# EAGLE design ERPIHAT01 (EAGLE 7.1.0)
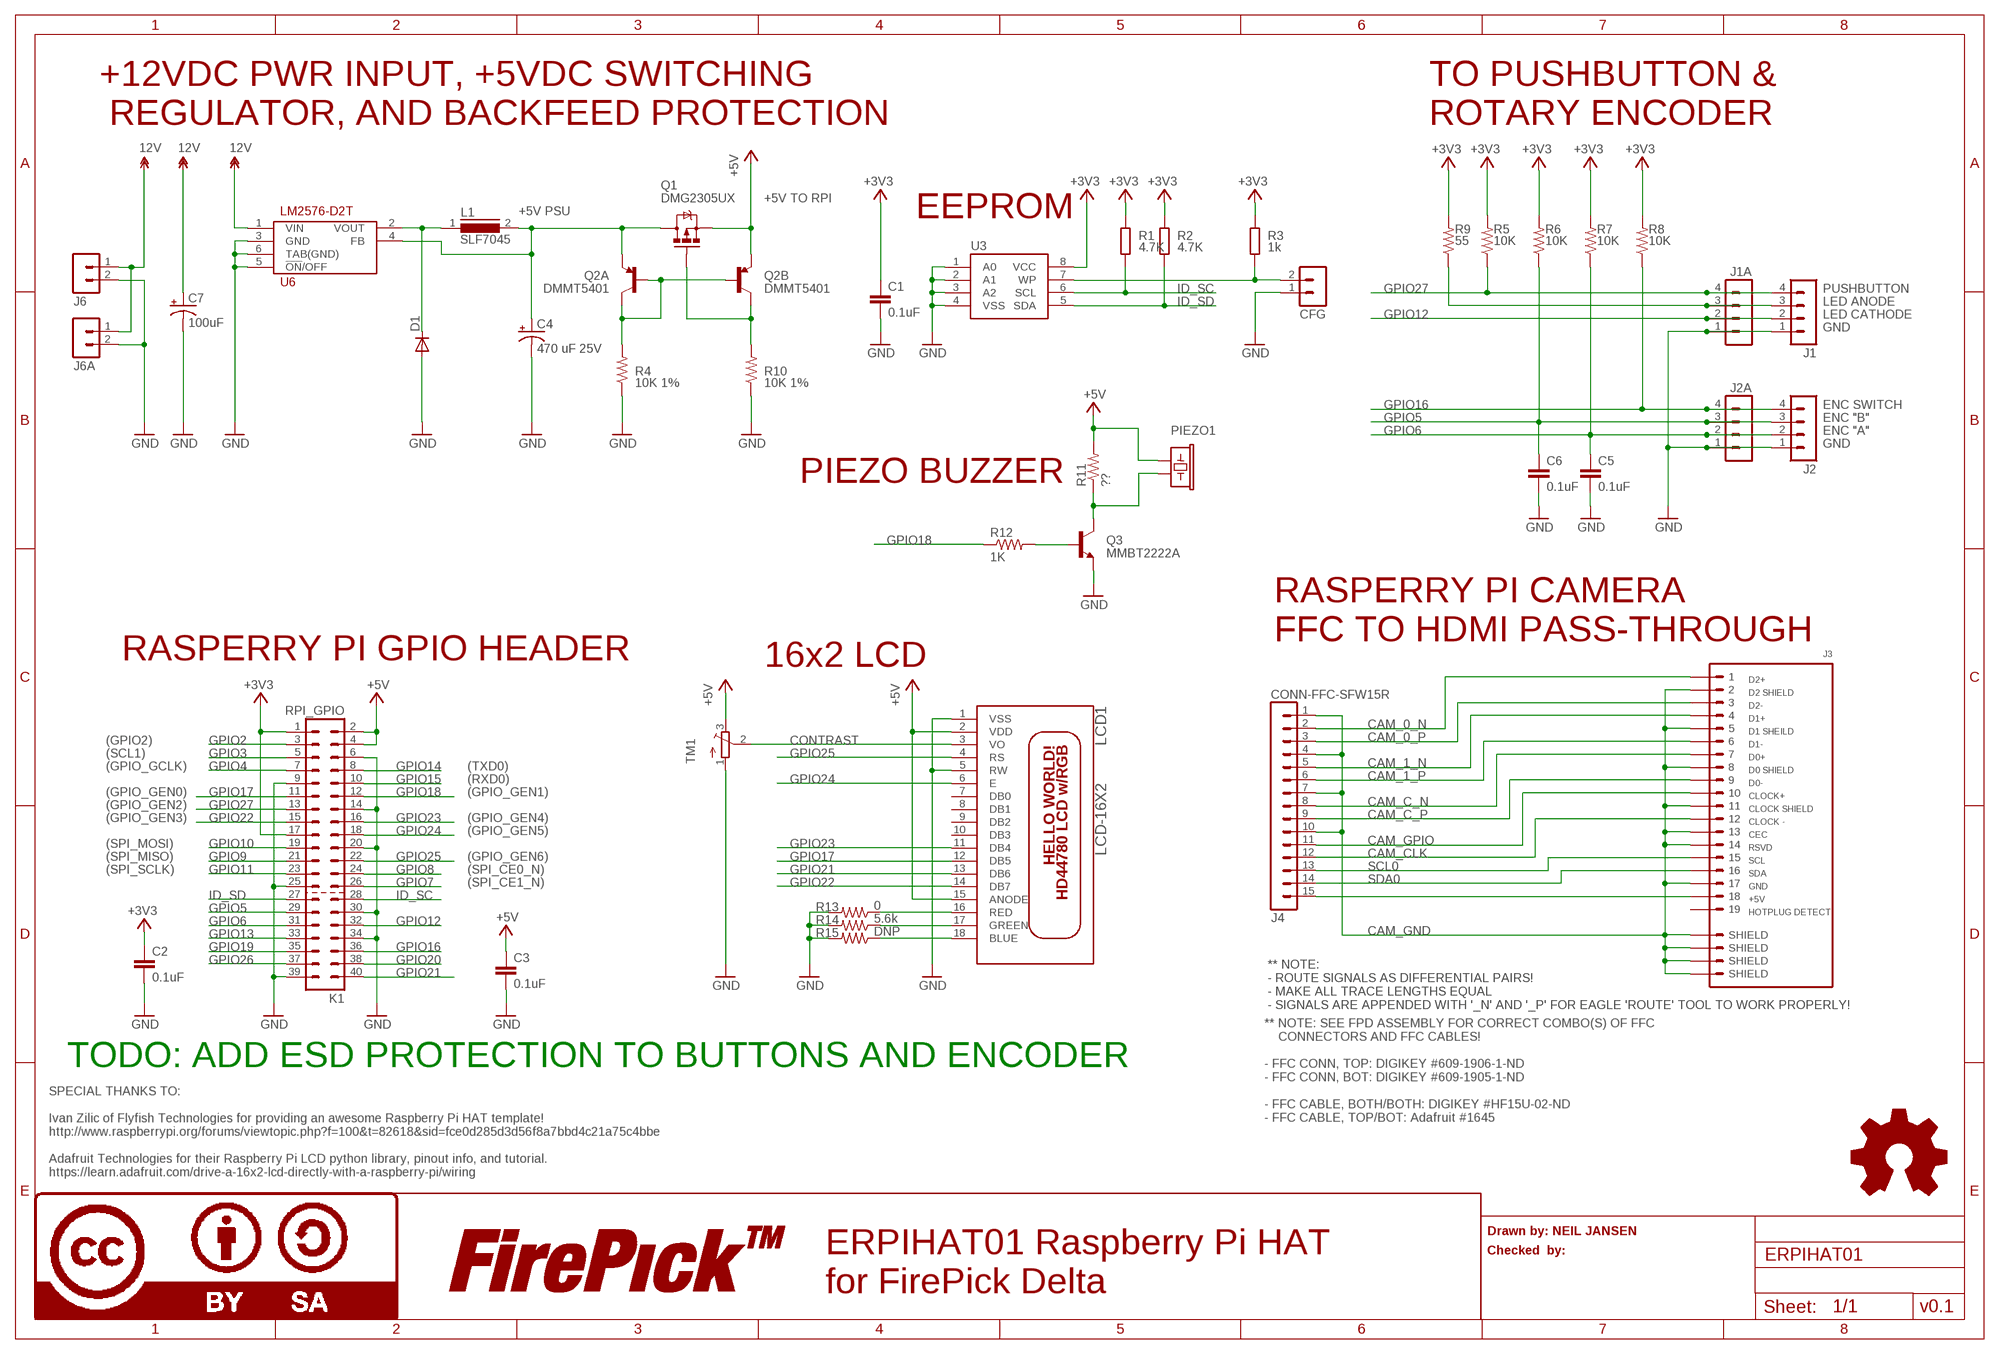
[diagram p0: schematic, sheet 1]

## Parts
C1  0.1uF  C-EUC0805K  [C0805K]
C2  0.1uF  C-EUC0805K  [C0805K]
C3  0.1uF  C-EUC0805K  [C0805K]
C4  470 uF 25V  CPOL-USD  [PANASONIC_D]
C5  0.1uF  CAP0805  [0805]
C6  0.1uF  CAP0805  [0805]
C7  100uF  CPOL-USD  [PANASONIC_D]
CFG  MA02-1  [MA02-1]
D1  DIODE-DO-214AC  [DO-214AC]
J1  CONN-RECT-4PINJST-PH-2MM  [CONN-JST-PH_2.0MM_4PIN-SMT-RA]
J1A  MA04-1  [MA04-1]
J2  CONN-RECT-4PINJST-PH-2MM  [CONN-JST-PH_2.0MM_4PIN-SMT-RA]
J2A  MA04-1  [MA04-1]
J3  CONN-HDMI  [CON-HDMI-FCI-10029449-001RLF]
J4  CONN-FFC-SFW15R  [CON-FFC-SFW15R]
J6  CONN-RECT-2PIN  [CONN-JST_PH-2.0MM-2PIN-SMT-RA]
J6A  MA02-1  [MA02-1]
K1  RPI_GPIO  PIN20X2  [PIN_20X2]
L1  SLF7045  [SLF7045]
LCD1  LCD-16X2  [LCD-16X2]
LOGO1  LOGO-FIREPICK  [LOGO-FIREPICK]
LOGO2  LOGO-OSHWMEDIUM  [LOGO-OSHW-MEDIUM]
LOGO3  LOGO-CC-BY-SA  [LOGO-CC-BY-SA]
PIEZO1  BUZZERPTH  [BUZZER-12MM]
Q1  DMG2305UX  MOSFET-PCHANNEL  [SOT23-3]
Q2  DMMT5401  [SOT23-6]
Q3  MMBT2222A  TRANSISTOR_NPNMMBT2222A  [SOT23-3]
R1  4.7K  R-EU_M0805  [M0805]
R2  4.7K  R-EU_M0805  [M0805]
R3  1k  R-EU_M0805  [M0805]
R4  10K 1%  RESISTOR0805-RES  [0805]
R5  10K  RESISTOR0805-RES  [0805]
R6  10K  RESISTOR0805-RES  [0805]
R7  10K  RESISTOR0805-RES  [0805]
R8  10K  RESISTOR0805-RES  [0805]
R9  55  RESISTOR0805-RES  [0805]
R10  10K 1%  RESISTOR0805-RES  [0805]
R11  ??  RESISTOR0805-RES  [0805]
R12  1K  RESISTOR0805-RES  [0805]
R13  0  RESISTOR0805-RES  [0805]
R14  5.6k  RESISTOR0805-RES  [0805]
R15  DNP  RESISTOR0805-RES  [0805]
TM1  TRIMPOTTC33X  [TC33X]
U3  EEPROM-I2CEIAJ  [SO08-EIAJ]
U6  LM2576-D2T  [D2PAK]

## Nets
12V: C7.+ J6.1 J6A.1 U6.1(VIN)
+3V3: C1.1 C2.1 K1.1 K1.17 R1.2 R2.2 R3.2 R5.2 R6.2 R7.2 R8.2 R9.2 U3.8(VCC)
+5V: C3.1 K1.2 K1.4 LCD1.2(VDD) LCD1.15(ANODE) PIEZO1.+ Q1.2(S) Q2.5(B:E) R11.2 TM1.3(E)
BLUE: LCD1.18(BLUE) R15.1
BUZZ: PIEZO1.- Q3.3(C) R11.1
CAM_0_N: J3.1 J4.2
CAM_0_P: J3.3 J4.3
CAM_1_N: J3.4 J4.5
CAM_1_P: J3.6 J4.6
CAM_C_N: J3.7 J4.8
CAM_C_P: J3.9 J4.9
CAM_GND: J3.2 J3.5 J3.8 J3.11 J3.13 J3.14 J3.17 J3.SHIELD1(SHIELD) J3.SHIELD2(SHIELD) J3.SHIELD3(SHIELD) J3.SHIELD4(SHIELD) J4.1 J4.4 J4.7 J4.10
CAM_GPIOCLK_N: J3.10 J4.11
CAM_GPIOCLK_P: J3.12 J4.12
CAM_SCLSDA_N: J3.15 J4.13
CAM_SCLSDA_P: J3.16 J4.14
CONTRAST: LCD1.3(VO) TM1.2(S)
FEEDBACK: C4.+ L1.2 Q1.3(D) Q2.6(A:E) U6.4(FB)
GND: C1.2 C2.2 C3.2 C4.- C5.2 C6.2 C7.- CFG.1 D1.A J1.1 J1A.1 J2.1 J2A.1 J6.2 J6A.2 K1.6 K1.9 K1.14 K1.20 K1.25 K1.30 K1.34 K1.39 LCD1.1(VSS) LCD1.5(RW) Q3.2(E) R4.1 R10.1 R13.2 R14.2 R15.2 TM1.1(A) U3.1(A0) U3.2(A1) U3.3(A2) U3.4(VSS) U6.3(GND) U6.5(!ON!/OFF) U6.6(TAB(GND))
GPIO2: K1.3
GPIO3: K1.5
GPIO4: K1.7
GPIO5: C6.1 J2.3 J2A.3 K1.29 R6.1
GPIO6: C5.1 J2.2 J2A.2 K1.31 R7.1
GPIO7: K1.26
GPIO8: K1.24
GPIO9: K1.21
GPIO10: K1.19
GPIO11: K1.23
GPIO12: J1.2 J1A.2 K1.32
GPIO13: K1.33
GPIO14: K1.8
GPIO15: K1.10
GPIO16: J2.4 J2A.4 K1.36 R8.1
GPIO17: K1.11 LCD1.12(DB5)
GPIO18: K1.12 R12.1
GPIO19: K1.35
GPIO20: K1.38
GPIO21: K1.40 LCD1.13(DB6)
GPIO22: K1.15 LCD1.14(DB7)
GPIO23: K1.16 LCD1.11(DB4)
GPIO24: K1.18 LCD1.6(E)
GPIO25: K1.22 LCD1.4(RS)
GPIO26: K1.37
GPIO27: J1.4 J1A.4 K1.13 R5.1
GREEN: LCD1.17(GREEN) R14.1
ID_SC: K1.28 R1.1 U3.6(SCL)
ID_SD: K1.27 R2.1 U3.5(SDA)
N$1: J3.18 J4.15
N$4: Q2.1(A:C) Q2.2(A:B) Q2.3(B:B) R4.2
N$5: Q1.1(G) Q2.4(B:C) R10.2
N$6: Q3.1(B) R12.2
N$7: CFG.2 R3.1 U3.7(WP)
PANEL_LED_RED: J1.3 J1A.3 R9.1
RED: LCD1.16(RED) R13.1
VOUT: D1.C L1.1 U6.2(VOUT)
Unconnected: J3.19 LCD1.7(DB0) LCD1.8(DB1) LCD1.9(DB2) LCD1.10(DB3)

## Notes on the sheet
- +12VDC PWR INPUT, +5VDC SWITCHING
   REGULATOR, AND BACKFEED PROTECTION
- TO PUSHBUTTON & 
  ROTARY ENCODER
- +5V TO RPI
- +5V PSU | EEPROM
- PUSHBUTTON
- LED ANODE
- LED CATHODE
- GND
- ENC SWITCH
- ENC "B"
- ENC "A"
- GND
- PIEZO BUZZER
- RASPERRY PI CAMERA
  FFC TO HDMI PASS-THROUGH
- RASPERRY PI GPIO HEADER | 16x2 LCD
- (GPIO2)
- (SCL1)
- (GPIO_GCLK) | (TXD0)
- (RXD0)
- (GPIO_GEN0) | (GPIO_GEN1)
- (GPIO_GEN2)
- (GPIO_GEN3) | (GPIO_GEN4)
- (GPIO_GEN5)
- (SPI_MOSI) | CAM_GPIO
- (SPI_MISO) | (GPIO_GEN6) | CAM_CLK
- (SPI_SCLK) | (SPI_CE0_N) | SCL0
- (SPI_CE1_N) | SDA0
- ** NOTE:
  - ROUTE SIGNALS AS DIFFERENTIAL PAIRS!
  - MAKE ALL TRACE LENGTHS EQUAL
  - SIGNALS ARE APPENDED WITH '_N' AND '_P' FOR EAGLE 'ROUTE' TOOL TO WORK PROPERLY!
- TODO: ADD ESD PROTECTION TO BUTTONS AND ENCODER
- ** NOTE: SEE FPD ASSEMBLY FOR CORRECT COMBO(S) OF FFC
      CONNECTORS AND FFC CABLES! 
  
  - FFC CONN, TOP: DIGIKEY #609-1906-1-ND
  - FFC CONN, BOT: DIGIKEY #609-1905-1-ND
  
  - FFC CABLE, BOTH/BOTH: DIGIKEY #HF15U-02-ND
  - FFC CABLE, TOP/BOT: Adafruit #1645
- SPECIAL THANKS TO:
  
  Ivan Zilic of Flyfish Technologies for providing an awesome Raspberry Pi HAT template!
  http://www.raspberrypi.org/forums/viewtopic.php?f=100&t=82618&sid=fce0d285d3d56f8a7bbd4c21a75c4bbe
  
  Adafruit Technologies for their Raspberry Pi LCD python library, pinout info, and tutorial.
  https://learn.adafruit.com/drive-a-16x2-lcd-directly-with-a-raspberry-pi/wiring
- Drawn by: NEIL JANSEN
- Checked  by:
- ERPIHAT01 Raspberry Pi HAT 
  for FirePick Delta
- v0.1

## Library data of the parts
C1-C3 = resistor:C-EU: CAPACITOR, European symbol; DIELECTRIC: X7R
C4 C7 = rcl:CPOL-US: POLARIZED CAPACITOR, American symbol
C5 C6 = SparkFun-Capacitors:CAP: Capacitor Standard 0603 ceramic capacitor, and 0.1" leaded capacitor.; DIELECTRIC: X7R
CFG J6A = !con-lstb:MA02-1
D1 = diode:DIODE-: DIODE
J1 J2 = FirePick:CONN-RECT-4PIN
J1A J2A = !con-lstb:MA04-1: PIN HEADER
J3 = FirePick:CONN-HDMI
J4 = FirePick:CONN-FFC-SFW15R
J6 = FirePick:CONN-RECT-2PIN
K1 = FLYFISH:PIN20X2
L1 = inductors:SLF7045: SMD Inductors(Coils) For Power Line (Wound, Magnetic Shielded) Source: TDK, e531_slf7045.pdf
LCD1 = FirePick:LCD-16X2
LOGO1 = FirePick:LOGO-FIREPICK
LOGO2 = FirePick:LOGO-OSHW
LOGO3 = FirePick:LOGO-CC-BY-SA
PIEZO1 = !SparkFun-2010-04-13:BUZZER: Buzzer 12mm Spark Fun Electronics SKU : Comp-Buzzer
Q1 = SparkFun-DiscreteSemi:MOSFET-PCHANNEL: Generic PMOSFET; PROD_ID: TRANS-08285
Q2 = FirePick:DMMT5401
Q3 = SparkFun-DiscreteSemi:TRANSISTOR_NPN: Generic NPN BJT MMBT2222A - TRANS-08049 (SOT-23, 1A 40V) MPSA42 - TRANS-09116 (SOT-23, 500mA 300V) MMBT5088LT1G - TRANS-11160 (SOT-23, 50 mA 30V); PROD_ID: TRANS-08049
R1-R3 = resistor:R-EU_: RESISTOR, European symbol; TOLERANCE: 5%
R4-R15 = SparkFun-Passives:RESISTOR: Resistor Basic schematic elements and footprints for 0603, 1206, and PTH resistors.
TM1 = adafruit:TRIMPOT: SMT trimmer potentiometer part number TC33X http://www.ladyada.net/library/eagle
U3 = SparkFun-DigitalIC:EEPROM-I2C: I2C EEPROM chips, 24LC256 (and others)
U6 = FirePick:LM2576-D2T

## Board
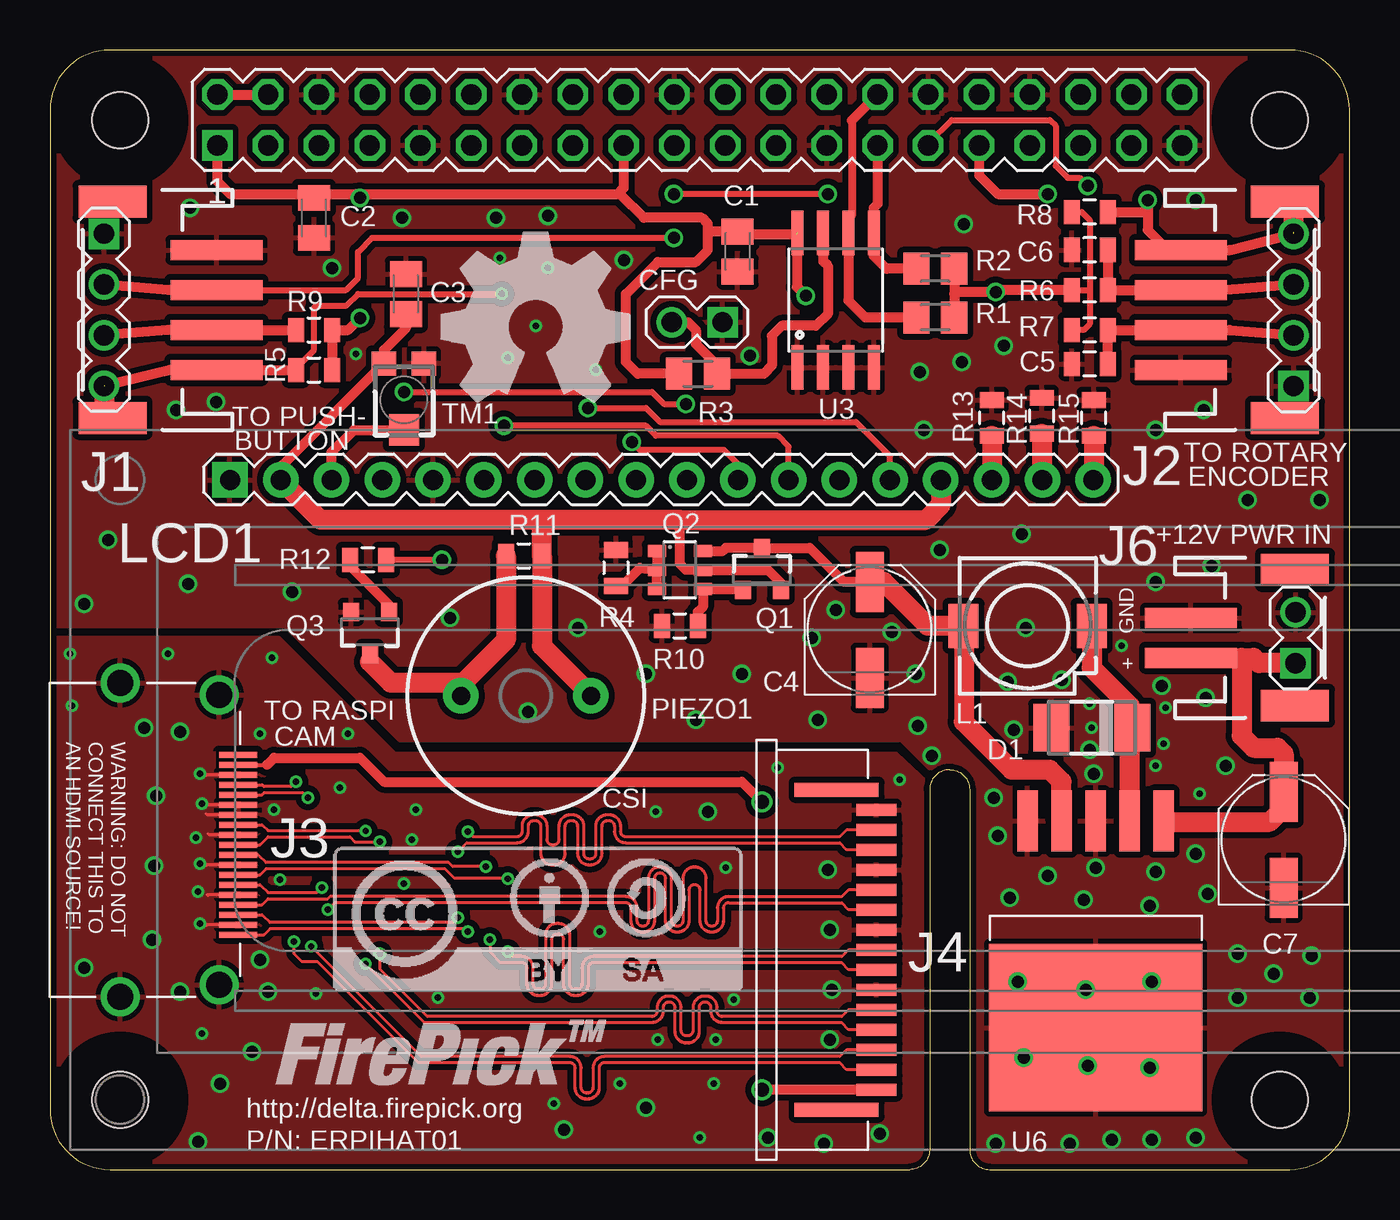
[diagram p1: board, top side]
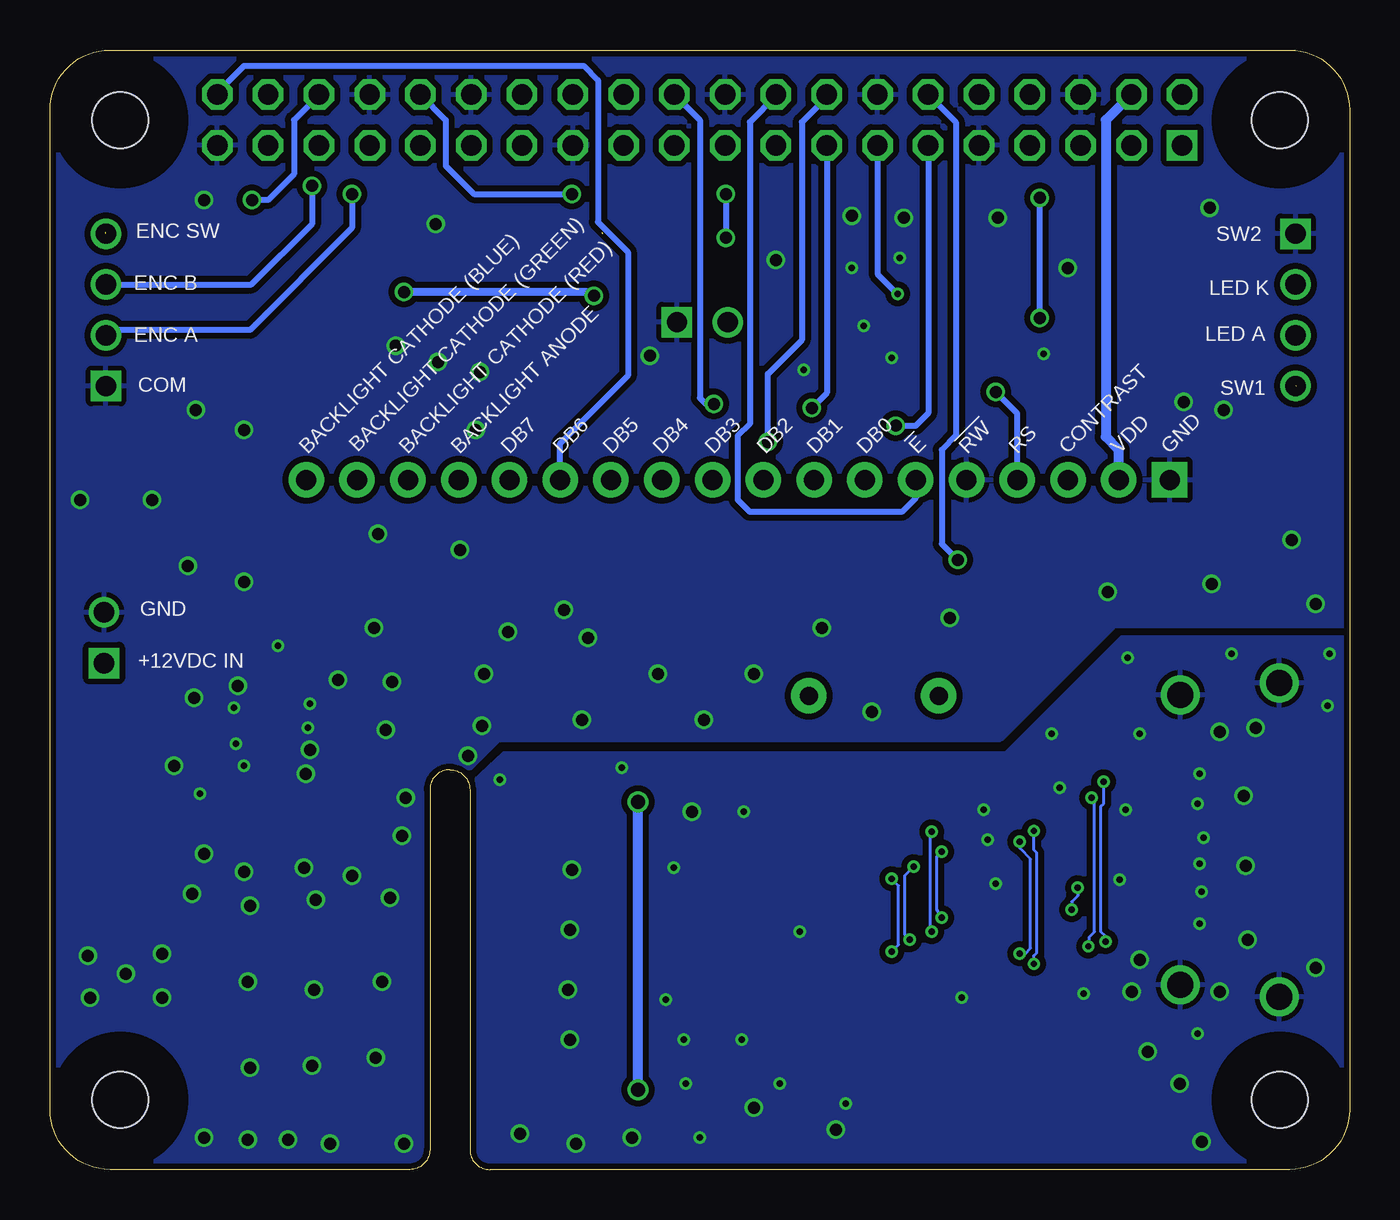
[diagram p2: board, bottom side, seen from below]

Size 65 x 56 mm. Coordinates in mm from the lower left corner, seen from the top.
Outline: 0,3 arc90 3,0 43,0 arc90 44,1 44,19 arc-90 45,20 arc-90 46,19 46,1 arc90 47,0 62,0 arc90 65,3 65,53 arc90 62,56 3,56 arc90 0,53 0,3
Copper layers (1*16): Top 0.035mm / dielectric 1.5mm / Bottom 0.035mm
Design rules "SeeedStudio_2layer_DRU_no_angle_20140221": minimum track width 6mil, minimum drill 12mil, track to track 6mil, track to pad 6mil, pad to pad 6mil, via to via 6mil, smd to smd 0mil, copper to edge 10mil, drill to drill 10mil, minimum pad ring 10mil, minimum via ring 6mil, stop-mask expansion 2mil, vias tented up to drill 100mil, thermal gap 10mil
Holes 2.8 mm at 3.5,3.5 3.5,52.5 61.5,52.5 61.5,3.5
tRestrict: area 1.9,51 to 5,54; area 60,51 to 63,54; area 60,1.9 to 63,5; area 1.9,1.9 to 5,5
bRestrict: area 1.9,1.9 to 5,5; area 1.9,51 to 5,54; area 60,1.9 to 63,5; area 60,51 to 63,54

### Footprints (pad centres in the part's own frame; a part is rotated, then mirrored left to right if it is on the bottom)
C0805K = smd 1.3 x 1.6: 1 -1,0; 2 1,0
PANASONIC_D = smd 3 x 1.4: + 2.4,0; - -2.4,0
0805 = smd 0.8 x 1.2: 1 -0.9,0; 2 0.9,0
MA02-1 = drill 1.016 square: 1 -1.27,0 | drill 1.016: 2 1.27,0
DO-214AC = smd 1.8 x 2.4: A 2.025,0; C -2.025,0
CONN-JST-PH_2.0MM_4PIN-SMT-RA = smd 1 x 4.6: 1 3,-2.43; 2 1,-2.43; 3 -1,-2.43; 4 -3,-2.43 | smd 1.6 x 3.4: NC1 -5.4,2.77; NC2 5.4,2.77
MA04-1 = drill 1.016 square: 1 -3.81,0 | drill 1.016: 2 -1.27,0; 3 1.27,0; 4 3.81,0
CON-HDMI-FCI-10029449-001RLF = smd 0.3 x 1.9: 1 4.75,3.81; 2 4.25,3.81; 3 3.75,3.81; 4 3.25,3.81; 5 2.75,3.81; 6 2.25,3.81; 7 1.75,3.81; 8 1.25,3.81; 9 0.75,3.81; 10 0.25,3.81; 11 -0.25,3.81; 12 -0.75,3.81; 13 -1.25,3.81; 14 -1.75,3.81; 15 -2.25,3.81; 16 -2.75,3.81; 17 -3.25,3.81; 18 -3.75,3.81; 19 -4.25,3.81 | drill 1.3: SHIELD1 -7.25,2.86; SHIELD2 -7.85,-2.09; SHIELD3 7.25,2.86; SHIELD4 7.85,-2.09
CON-FFC-SFW15R = smd 0.6 x 2: 1 -7,3.04; 2 -6,3.04; 3 -5,3.04; 4 -4,3.04; 5 -3,3.04; 6 -2,3.04; 7 -1,3.04; 8 0,3.04; 9 1,3.04; 10 2,3.04; 11 3,3.04; 12 4,3.04; 13 5,3.04; 14 6,3.04; 15 7,3.04 | smd 0.7 x 4.2: G1 -8,1.04; G2 8,1.04
CONN-JST_PH-2.0MM-2PIN-SMT-RA = smd 1 x 4.6: 1 1,-2.43; 2 -1,-2.43 | smd 1.6 x 3.4: NC1 -3.4,2.77; NC2 3.4,2.77
PIN_20X2 = drill 1.016 square: 1 -24.13,-1.27 | drill 1.016 octagon: 2 -24.13,1.27; 3 -21.59,-1.27; 4 -21.59,1.27; 5 -19.05,-1.27; 6 -19.05,1.27; 7 -16.51,-1.27; 8 -16.51,1.27; 9 -13.97,-1.27; 10 -13.97,1.27; 11 -11.43,-1.27; 12 -11.43,1.27; 13 -8.89,-1.27; 14 -8.89,1.27; 15 -6.35,-1.27; 16 -6.35,1.27; 17 -3.81,-1.27; 18 -3.81,1.27; 19 -1.27,-1.27; 20 -1.27,1.27; 21 1.27,-1.27; 22 1.27,1.27; 23 3.81,-1.27; 24 3.81,1.27; 25 6.35,-1.27; 26 6.35,1.27; 27 8.89,-1.27; 28 8.89,1.27; 29 11.43,-1.27; 30 11.43,1.27; 31 13.97,-1.27; 32 13.97,1.27; 33 16.51,-1.27; 34 16.51,1.27; 35 19.05,-1.27; 36 19.05,1.27; 37 21.59,-1.27; 38 21.59,1.27; 39 24.13,-1.27; 40 24.13,1.27
SLF7045 = smd 1.5 x 2.2: 1 -3.2,0; 2 3.2,0
LCD-16X2 = drill 1 pad 1.778 square: 1 -32,15.5 | drill 1 pad 1.778: 2 -29.46,15.5; 3 -26.92,15.5; 4 -24.38,15.5; 5 -21.84,15.5; 6 -19.3,15.5; 7 -16.76,15.5; 8 -14.22,15.5; 9 -11.68,15.5; 10 -9.14,15.5; 11 -6.6,15.5; 12 -4.06,15.5; 13 -1.52,15.5; 14 1.02,15.5; 15 3.56,15.5; 16 6.1,15.5; 17 8.64,15.5; 18 11.18,15.5
BUZZER-12MM = drill 0.9 pad 1.778: + 3.25,0; - -3.25,0
SOT23-3 = smd 0.8 x 0.9: 1 -0.95,-1; 2 0.95,-1; 3 0,1.1
SOT23-6 = smd 0.6 x 0.9: 1 -0.95,-1.15; 2 0,-1.15; 3 0.95,-1.15; 4 0.95,1.15; 5 0,1.15; 6 -0.95,1.15
M0805 = smd 1.3 x 1.6: 1 -0.95,0; 2 0.95,0
TC33X = smd 1.2 x 1.2: 1 -1,-1.825; 3 1,-1.825 | smd 1.5 x 1.6: 2 0,1.5
SO08-EIAJ = smd 0.61 x 2.21: 1 -1.905,-3.378; 2 -0.635,-3.378; 3 0.635,-3.378; 4 1.905,-3.378; 5 1.905,3.353; 6 0.635,3.353; 7 -0.635,3.353; 8 -1.905,3.353
D2PAK = smd 1.016 x 3.05: 1 -3.404,-10.33; 2 -1.702,-10.33; 3 0,-10.33; 4 1.702,-10.33; 5 3.404,-10.33 | smd 10.66 x 8.38: 6 0,0

### Placement (x,y rotation side)
C1  34.4,45.92 270 top
C2  13.2,47.6 270 top
C3  17.8,43.8 90 top
C4  41,27 90 top
C5  52,40.3 180 top
C6  52,46 180 top
C7  61.7,16.5 90 top
CFG  32.37,42.38 180 top
D1  52.1,22.1 180 top
J1  5.9,43 90 top
J1A  2.7,43 270 top
J2  59,43 270 top
J2A  62.2,43 90 top
J3  5.6,16.5 270 top
J4  38.3,11 270 top
J6  59.5,26.6 270 top
J6A  62.3,26.6 90 top
K1  32.5,52.5 0 top
L1  48.9,27.2 180 top
LCD1  41,19 0 top
LOGO1  11.1,2.5 0 top
LOGO2  24.3,42.2 0 top
LOGO3  14.2,9 0 top
PIEZO1  23.8,23.7 0 top
Q1  35.6,30 0 top
Q2  31.5,30 270 top
Q3  16,26.9 180 top
R1  44.27,42.62 0 top
R2  44.27,45.06 0 top
R3  32.41,39.8 180 top
R4  28.3,30.1 270 top
R5  13.2,40 0 top
R6  52,44 180 top
R7  52,42 180 top
R8  52,47.9 180 top
R9  13.2,42 0 top
R10  31.5,27.2 0 top
R11  23.7,30.7 0 top
R12  15.9,30.5 180 top
R13  47.1,37.6 90 top
R14  49.6,37.7 90 top
R15  52.2,37.6 90 top
TM1  17.7,38.5 180 top
U3  39.3,43.5 0 top
U6  52.3,7.1 180 top

### Tracks (layer width: path | path; a pad name or v marks a point on that pad's centre or on a via)
12V
  Top 1: U6.1 55.73,17.4 61,17.4 61.6,18 61.6,18.8 C7.+ 61.7,20.8 61.4,21.1 60.2,21.1 59.6,21.7 59.6,25.6 | J6A.1 60.47,25.33 60.2,25.6 59.6,25.6 | J6.1 59.6,25.6
+3V3  (via drill 0.6)  (1 unrouted)
  Top 0.3: R8.2 51.6,47.9 52,47.5 52,44 | 52,44 52,42.3 51.7,42 R7.2 | R6.2 52,44 | 47.6,43.9 47.7,44 | v15.5,48.6 15.3,48.8 | 32.92,46.92 32.9,46.9 | 28.39,48.8 28.5,48.8 | C1.1 34.4,46.9 34.5,46.8
  Top 0.5: v37.8,43.7 37.35,44.15 37.35,46.8 34.5,46.8 | K1.17 28.69,49.1 28.39,48.8 15.3,48.8 13.3,48.8 | K1.1 8.37,49.43 9,48.8 13.3,48.8 | C2.1 13.2,48.7 13.3,48.8 | R3.2 29.4,39.8 28.8,40.4 28.8,43.8 30.4,45.4 32.3,45.4 32.9,46 32.9,46.9 32.9,47.3 32.6,47.6 29.7,47.6 28.5,48.8 | 47.6,43.9 v47.3,43.9 45.33,43.9 45.23,43.8 | R6.2 47.7,44 | R5.2 R9.2 14.9,42 v15.5,42.6 | C1.1 32.92,46.92 | R2.2 45.23,43.8 | 45.23,43.8 R1.2
  Bottom 0.3: v15.5,42.6 v15.5,48.6
  Bottom 0.406: v37.8,43.7 38,43.7 38.2,43.9 v47.3,43.9
+5V
  Top 0.5: K1.2 K1.4 | Q1.2 36.55,29.35 35.9,30 Q2.5 31.8,30 31.5,30.3 31.5,32.5 | 24.6,32.3 24.8,32.5 | LCD1.2 11.6,34.56 11.6,35.23 TM1.3 | TM1.3 16.62,40.33 | C3.1 17.8,42.1 16.7,41 TM1.3
  Top 1: LCD1.2 13.54,32.5 24.8,32.5 31.5,32.5 43.8,32.5 44.56,33.26 LCD1.15 | 24.6,32.3 R11.2 24.6,26.2 27.15,23.65 PIEZO1.+
  Bottom 0.5: LCD1.2 11.54,36 12.2,36.66 12.2,52.5 12.18,52.5 K1.4
BLUE
  Top 0.5: 52.2,34.52 LCD1.18
  Top 1: R15.1 52.2,34.52
BUZZ
  Top 0.5: Q3.3 16,25.4
  Top 1: R11.1 22.8,26.5 20.65,24.35 | PIEZO1.- 20.65,24.35 | 16,25.4 17.05,24.35 20.65,24.35
CAM_0_N  (via drill 0.3)
  Top 0.152: J3.1 10.7,11.75 11,12.05 20.75,12.05 v20.9,11.9 | J4.2 39.85,17 39.5,16.65 28.8,16.65 arc-90 28.53,16.92 28.53,17.19 arc90 27.96,17.76 27.88,17.76 arc90 27.31,17.19 27.31,15.81 arc-90 27.04,15.55 26.96,15.55 arc-90 26.69,15.81 26.69,17.19 arc90 26.12,17.76 26.04,17.76 arc90 25.47,17.19 25.47,16.51 arc-90 25.2,16.25 25.12,16.25 arc-90 24.85,16.51 24.85,17.19 arc90 24.28,17.76 24.2,17.76 arc90 23.62,17.19 23.62,16.92 arc-90 23.36,16.65 21.14,16.65 v20.9,16.9
  Bottom 0.152: v20.9,11.9 20.95,12 20.95,16.85 v20.9,16.9
CAM_0_P  (via drill 0.3)
  Top 0.152: J3.3 10.6,12.75 11,12.35 20.15,12.35 v20.4,12.6 | J4.3 39.85,16 39.5,16.35 28.8,16.35 arc-90 28.23,16.92 28.23,17.19 arc90 27.96,17.45 27.88,17.45 arc90 27.61,17.19 27.61,15.81 arc-90 27.04,15.24 26.96,15.24 arc-90 26.39,15.81 26.39,17.19 arc90 26.12,17.45 26.04,17.45 arc90 25.77,17.19 25.77,15.81 arc-90 25.2,15.24 25.12,15.24 arc-90 24.55,15.81 24.55,17.19 arc90 24.28,17.45 24.2,17.45 arc90 23.93,17.19 23.93,16.92 arc-90 23.36,16.35 20.85,16.35 v20.4,15.9
  Bottom 0.152: v20.4,12.6 20.65,13 20.65,15.65 v20.4,15.9
CAM_1_N
  Top 0.152: J3.4 10.6,13.25 10.9,13.55 13.89,13.55 14,13.65 28.8,13.65 arc-90 29.37,13.08 29.37,12.44 arc90 29.64,12.17 29.66,12.17 arc90 29.93,12.44 29.93,14.56 arc-90 30.5,15.13 30.52,15.13 arc-90 31.1,14.56 31.1,12.44 arc90 31.36,12.17 31.39,12.17 arc90 31.66,12.44 31.66,14.56 arc-90 32.23,15.13 32.25,15.13 arc-90 32.82,14.56 32.82,12.44 arc90 33.09,12.17 33.11,12.17 arc90 33.38,12.44 33.38,13.08 arc-90 33.95,13.65 39.6,13.65 39.95,14 J4.5
CAM_1_P  (via drill 0.3)
  Top 0.152: J3.6 10.5,14.25 10.9,13.85 13.35,13.85 v13.6,14.1 | J4.6 39.95,13 39.6,13.35 33.95,13.35 arc90 33.69,13.08 33.69,12.44 arc-90 33.11,11.87 33.09,11.87 arc-90 32.52,12.44 32.52,13.98 arc90 32.25,14.24 32.23,14.24 arc90 31.96,13.98 31.96,12.44 arc-90 31.39,11.87 31.36,11.87 arc-90 30.79,12.44 30.79,14.56 arc90 30.52,14.83 30.5,14.83 arc90 30.23,14.56 30.23,12.44 arc-90 29.66,11.87 29.64,11.87 arc-90 29.07,12.44 29.07,13.08 arc90 28.8,13.35 14.25,13.35 v13.9,13
  Bottom 0.152: v13.6,14.1 13.6,13.7 13.9,13.4 v13.9,13
CAM_C_N  (via drill 0.3)
  Top 0.152: J4.8 39.95,11 39.6,10.65 27.18,10.65 arc90 26.61,10.08 26.61,9.27 arc-90 26.34,9 26.27,9 arc-90 26,9.27 26,11.73 arc90 25.43,12.3 25.35,12.3 arc90 24.78,11.73 24.78,9.27 arc-90 24.52,9 24.44,9 arc-90 24.17,9.27 24.17,10.08 arc90 23.6,10.65 23.15,10.65 v22.9,10.9 | J3.7 10.5,14.75 10.8,15.05 19.75,15.05 20.2,14.6 22.85,14.6 v22.9,14.55
  Bottom 0.152: v22.9,10.9 22.55,11.25 22.55,14.2 v22.9,14.55
CAM_C_P  (via drill 0.3)
  Top 0.152: J4.9 39.95,10 39.6,10.35 27.18,10.35 arc90 26.92,10.08 26.92,9.27 arc-90 26.34,8.7 26.27,8.7 arc-90 25.7,9.27 25.7,11.51 arc90 25.43,11.77 25.35,11.77 arc90 25.09,11.51 25.09,9.27 arc-90 24.52,8.7 24.44,8.7 arc-90 23.87,9.27 23.87,10.08 arc90 23.6,10.35 22.55,10.35 22,10.89 v22,11.5 | J3.9 10.4,15.75 10.8,15.35 19.95,15.35 20.15,15.15 v21.8,15.15
  Bottom 0.152: v22,11.5 22.25,11.75 22.25,14.71 v21.8,15.15
CAM_GND  (via drill 0.3, 0.6)
  Top 0.152: J3.17 7.85,19.75 7.8,19.7 | J3.13 7.85,17.75 7.8,17.8 | J3.11 7.95,16.75 7.9,16.8 | J3.8 7.85,15.25 7.8,15.2 | J3.5 7.85,13.75 7.9,13.7 | J3.2 7.85,12.25 7.8,12.2 | J3.14 7.85,18.25
  other vias: 7.6,6.8 7.3,16.6 30.3,17.9 7.4,13.9 18.1,16.5 7.5,15.3 7.5,12.3 5.9,25.8 32.5,1.6 13.3,8.8 17.7,14.3 33.8,15.1 11.1,25.6 14.5,19.1 33.3,6.5 11.2,18 18.3,18 42.5,19.5 29.8,3.1 39.1,9 39,12 36.4,20.1 34.2,8.5 11.5,14.5 30.4,6.5 33.2,4.3 7.5,19.8 28.5,4.3 25.2,3.3 27.5,11.9 19.4,8.6 7.6,18.3 1.1,23.2 1,25.8 6.5,21.9 4.7,22.1 5.2,15.2 1.7,10.1 5.1,11.5 10.5,10.5 6.5,8.9 10.9,8.9 7.4,1.4 25.7,2 32.9,17.9 39,6.5 38.7,1.3 38.9,15 41.5,1.8 8.5,4.3 10.1,5.9 5.3,18.7 35.9,1.6 14.9,21.8 10.5,21.8
  pour Top (isolate 0.3): 0.1,26.6 11.4,26.6 17.2,20.8 42.3,20.8 43.8,19.4 43.8,0.3 2.8,0.1 0.1,2.9
  pour Top: 7.9,20.8 10.1,20.8 10.2,11.7 8,11.7
  pour Bottom (isolate 0.3): 0.1,26.6 11.4,26.6 17.2,20.8 42.3,20.8 43.8,19.4 43.9,0.2 2.8,0.1 0.1,2.9
CAM_GPIOCLK_N  (via drill 0.3)
  Top 0.152: J3.10 10.5,16.25 10.9,16.65 15,16.65 15.25,16.4 v16.5,16.4 | J4.11 39.95,8 39.6,7.65 33.63,7.65 arc-90 33.37,7.92 33.37,8.1 arc90 32.8,8.67 32.73,8.67 arc90 32.16,8.1 32.16,6.96 arc-90 31.9,6.69 31.84,6.69 arc-90 31.57,6.96 31.57,8.1 arc90 31,8.67 30.94,8.67 arc90 30.37,8.1 30.37,7.92 arc-90 30.1,7.65 18.86,7.65 16.5,10.02 v16.5,10.8
  Bottom 0.152: v16.5,10.8 16.22,10.8 15.95,11.06 15.95,15.54 16.5,16.08 v16.5,16.4
CAM_GPIOCLK_P  (via drill 0.3)
  Top 0.152: J3.12 10.6,17.25 10.9,16.95 15.78,16.95 v15.79,16.95 | J4.12 39.95,7 39.6,7.35 33.63,7.35 arc-90 33.06,7.92 33.06,8.1 arc90 32.8,8.37 32.73,8.37 arc90 32.47,8.1 32.47,6.9 arc-90 31.9,6.33 31.84,6.33 arc-90 31.27,6.9 31.27,8.1 arc90 31,8.37 30.94,8.37 arc90 30.67,8.1 30.67,7.92 arc-90 30.1,7.35 18.74,7.35 v15.79,10.29
  Bottom 0.152: 15.8,16.95 v15.79,16.95 v15.8,16.94 15.8,16 15.65,15.85 15.65,10.84 15.79,10.69 v15.79,10.29
CAM_SCLSDA_N  (via drill 0.3)
  Top 0.152: J3.15 10.6,18.75 10.7,18.85 12.65,18.85 v12.9,18.6 | J4.13 39.85,6 39.5,5.65 27.73,5.65 arc90 27.16,5.08 27.16,4.09 arc-90 26.89,3.83 26.84,3.83 arc-90 26.57,4.09 26.57,5.08 arc90 26,5.65 18.56,5.65 v13.06,11.16
  Bottom 0.152: v13.06,11.16 13.01,11.21 13.01,11.64 12.75,11.9 12.75,18.45 v12.9,18.6
CAM_SCLSDA_P  (via drill 0.3)
  Top 0.152: J3.16 10.6,19.25 10.7,19.15 12.05,19.15 v12.3,19.4 | J4.14 39.85,5 39.5,5.35 27.73,5.35 arc90 27.47,5.08 27.47,4.09 arc-90 26.89,3.52 26.84,3.52 arc-90 26.27,4.09 26.27,5.08 arc90 26,5.35 18.44,5.35 13.38,10.4 12.6,10.4 12.2,10.8 v12.2,11.4
  Bottom 0.152: v12.2,11.4 12.2,11.65 12.45,11.9 12.45,18.15 12.3,18.3 v12.3,19.4
CONTRAST
  Top 0.5: LCD1.3 14.08,35.88 15.2,37 TM1.2
FEEDBACK
  Top 0.5: Q2.6 33.65,30.95 33.8,31.1 Q1.3 38,31.1 39.7,29.4 C4.+
  Top 1: C4.+ 41.7,29.4 43.9,27.2 L1.2 45.7,22.4 48.1,20 50,20 50.6,19.4 U6.4
GND  (via drill 0.3, 0.6)
  other vias: 14.1,45.1 15.3,40.8 22.5,45.6 17.6,47.6 35,40.7 47.7,41.2 45.7,47.3 20,27.6 12.1,28.9 48.4,9.4 55.1,9.4 48,13.6 51.7,13.5 55,13.2 59.4,10.8 59.4,8.6 63,8.6 63.1,10.7 61.2,9.8 51.9,5.2 51.8,9 48.7,5.6 55,5.1 43.4,22.2 48.8,27.1 55.3,29.4 57.8,23.6 38.1,26.6 43.3,24.8 38.4,22.5 58.8,20.2 47.9,24.4 58.1,30.2 7,48.1 6.3,38 45.6,40.4 57.7,38 44.5,31 48.6,31.8 59.9,33.5 63.5,33.5 1.7,28.3 6.9,29.3 2.9,31.5 8.3,38.4 22.9,40.6 43.5,39.9 29.8,24.8 32.3,22.5 23.9,22.9 34.6,24.8 26.4,27.1 55.3,37 43.7,37 24.3,42.2 57.3,48.5 24.9,47.7 28.7,45.5 27.3,40 24.9,45.1 22.3,47.6 52.2,19.8 52,21 52.1,22.1 52,23.3 48.2,22 47.2,18.6 55.3,20.2 55.8,23.1 55.6,24.2 53.6,26.2 50.6,24.5 55.7,21.3 57.5,18.8 57.3,15.8 52.3,15.1 47.4,16.7 49.9,14.7 55.3,14.9 44.1,20.7 42.1,26.9 39.3,28 47.3,1.3 51,1.3 53.1,1.5 55.1,1.5 57.3,1.6 57.9,13.8
  pour Bottom (isolate 0.3): 44.3,19.8 arc-90 45,20 arc-90 46,19 46,1 arc90 47,0 62,0 arc90 65,3 65,53 arc90 62,56 3,56 arc90 0,53 0.1,27.2 11.8,27.2 17.5,21.5 42.6,21.5
  pour Top (isolate 0.3): 4.7,55.8 60.6,55.8 64.8,51 64.7,5.3 60.4,0.3 46.2,0.2 46.2,19.8 44.2,19.9 42.6,21.5 17.5,21.5 11.8,27.2 0.1,27.2 0.2,51 1.3,52.1
GPIO5  (via drill 0.6)
  Top 0.3: K1.29 43.93,51.33 45.1,52.5 50,52.5 50.3,52.2 50.3,50.2 50.9,49.6 51.5,49.6 v51.9,49.2
  Top 0.5: C6.1 R6.1 J2.3 58.8,44 J2A.3
  Bottom 0.3: v51.9,49.2 51.9,47.3 54.93,44.27 J2A.3
GPIO6  (via drill 0.6)
  Top 0.5: C5.1 R7.1 J2.2 59,42 J2A.2 | K1.31 46.47,49.73 47.4,48.8 v49.9,48.8
  Bottom 0.3: v49.9,48.8 49.9,47.1 55,42 61.93,42 J2A.2
GPIO12  (via drill 0.6)
  Top 0.3: J1.2 14.8,44 15.4,44.6 15.4,45.9 16.1,46.6 v31.2,46.6 | v38.9,48.8 v31.2,48.8
  Top 0.5: J1.2 5.9,44 J1A.2
  Bottom 0.3: K1.32 45.2,52.5 45.2,50.2 43.8,48.8 v38.9,48.8 | v31.2,48.8 v31.2,46.6
GPIO16  (via drill 0.6)  (1 unrouted)
  Top 0.3: 54.8,47.9 54.9,47.8
  Top 0.5: v54.9,48.5 54.9,47.8 54.9,47 55.9,46 J2.4 59,46 J2A.4 | R8.1 54.8,47.9
  Top 1: 62.2,46.9 62.2,48.4
  Bottom 0.3: K1.36 51.55,53.75 52.8,52.5 52.8,49.8 54.1,48.5 v54.9,48.5
GPIO17  (via drill 0.6)
  Top 0.3: LCD1.12 36.94,36.16 36.4,36.7 30.3,36.7 29.8,37.2 v22.7,37.2
  Bottom 0.3: K1.11 21.07,37.83 21.7,37.2 v22.7,37.2
GPIO18  (via drill 0.6)
  Top 0.3: v19.6,30.5 R12.1
  Bottom 0.3: K1.12 19.7,52.4 19.7,36.7 20.4,36 20.4,31.3 v19.6,30.5
GPIO21
  Bottom 0.3: K1.40 56.63,53.87 55.3,55.2 38.3,55.2 37.6,54.5 37.6,47.4 36.1,45.9 36.1,39.7 39.48,36.32 LCD1.13
GPIO22  (via drill 0.6)
  Top 0.3: LCD1.14 42.02,35.68 40.3,37.4 30.5,37.4 29.8,38.1 v26.9,38.1
  Bottom 0.3: K1.15 26.15,38.85 v26.9,38.1
GPIO23  (via drill 0.6)
  Top 0.3: LCD1.11 34.4,35.3 33.7,36 29.5,36 v29.1,36.4
  Bottom 0.3: K1.16 26.15,53.65 27.4,52.4 27.4,41.5 29.1,39.8 v29.1,36.4
GPIO24
  Bottom 0.3: K1.18 28.69,53.71 30,52.4 30,37.3 30.6,36.7 30.6,33.5 30,32.9 22.4,32.9 21.7,33.6 LCD1.6
GPIO25  (via drill 0.6)
  Top 0.3: v17.7,38.9 30.1,38.9 30.7,38.3 v31.8,38.3
  Bottom 0.3: K1.22 32.5,52.5 32.5,38.6 32.2,38.3 v31.8,38.3 | LCD1.4 16.62,37.82 v17.7,38.9
GPIO27  (via drill 0.3)  (1 unrouted)
  Top 0.3: R5.1 12.3,40.1 13.2,41 13.2,43.1 13.3,43.2 14.8,43.2 15.4,43.8 v22.6,43.8
  Top 0.5: R5.1 J1.4 6,40 J1A.4
  Top 1: J1A.4 2.7,37.6
  Bottom 0.3: K1.13 23.61,44.8 v22.61,43.8 v22.6,43.8
GREEN
  Top 0.5: 49.6,34.54 LCD1.17
  Top 1: R14.1 49.6,34.54
ID_SC
  Top 0.3: 39.94,47.53 40.1,47.7
  Top 0.406: 40.1,52.48 40.1,47.7
  Top 0.5: K1.28 40.1,52.48 | R1.1 40.78,42.62 39.94,43.47 U3.6 39.94,47.53
ID_SD
  Top 0.5: R2.1 41.84,45.06 41.2,45.7 U3.5 41.2,48.1 41.39,48.29 K1.27
N$1  (via drill 0.7)
  Top 0.2: J3.18 10.85,20.25
  Top 0.5: J4.15 v35.6,4 | 10.85,20.25 11.2,20.6 15.5,20.6 16.7,19.4 34.6,19.4 v35.6,18.4
  Bottom 0.5: v35.6,4 v35.6,18.4
N$4
  Top 0.5: Q2.1 Q2.2 | Q2.3 Q2.2 | R4.2 28.6,29.2 29.5,30.1 Q2.2
N$5
  Top 0.5: Q1.1 34.6,29.05 Q2.4 32.65,28.15 32.4,27.9 R10.2
N$6
  Top 0.5: R12.2 15,30.2 16.95,28.25 Q3.1
N$7
  Top 0.5: U3.7 38.66,45.44 38.9,45.2 38.9,42.8 38.3,42.2 36.6,42.2 36.1,41.7 36.1,40.2 35.7,39.8 R3.1 33.35,40.24 32.3,41.3 32.3,42 31.91,42.38 CFG.2
PANEL_LED_RED
  Top 0.5: R9.1 J1.3 5.9,42 J1A.3
RED
  Top 1: R13.1 LCD1.16
VOUT
  Top 1: U6.2 54,21.78 D1.C 54.02,23.18 52.1,25.1 L1.1

### Text on the board
tPlace: TO PUSH- | BUTTON | TO ROTARY | ENCODER | +12V PWR IN | GND | + | TO RASPI | WARNING: DO NOT / CONNECT THIS TO / AN HDMI SOURCE! | CAM | CSI | http://delta.firepick.org | P/N: ERPIHAT01
bPlace: SW2 | ENC SW | LED K | ENC B | LED A | ENC A | SW1 | COM | GND | VDD | CONTRAST | RS | !RW | !E | DB0 | DB1 | DB2 | DB3 | DB4 | DB5 | DB6 | DB7 | BACKLIGHT ANODE | BACKLIGHT CATHODE (RED) | BACKLIGHT CATHODE (GREEN) | BACKLIGHT CATHODE (BLUE) | GND | +12VDC IN